# EAGLE design Breadboard (EAGLE 9.4.2)
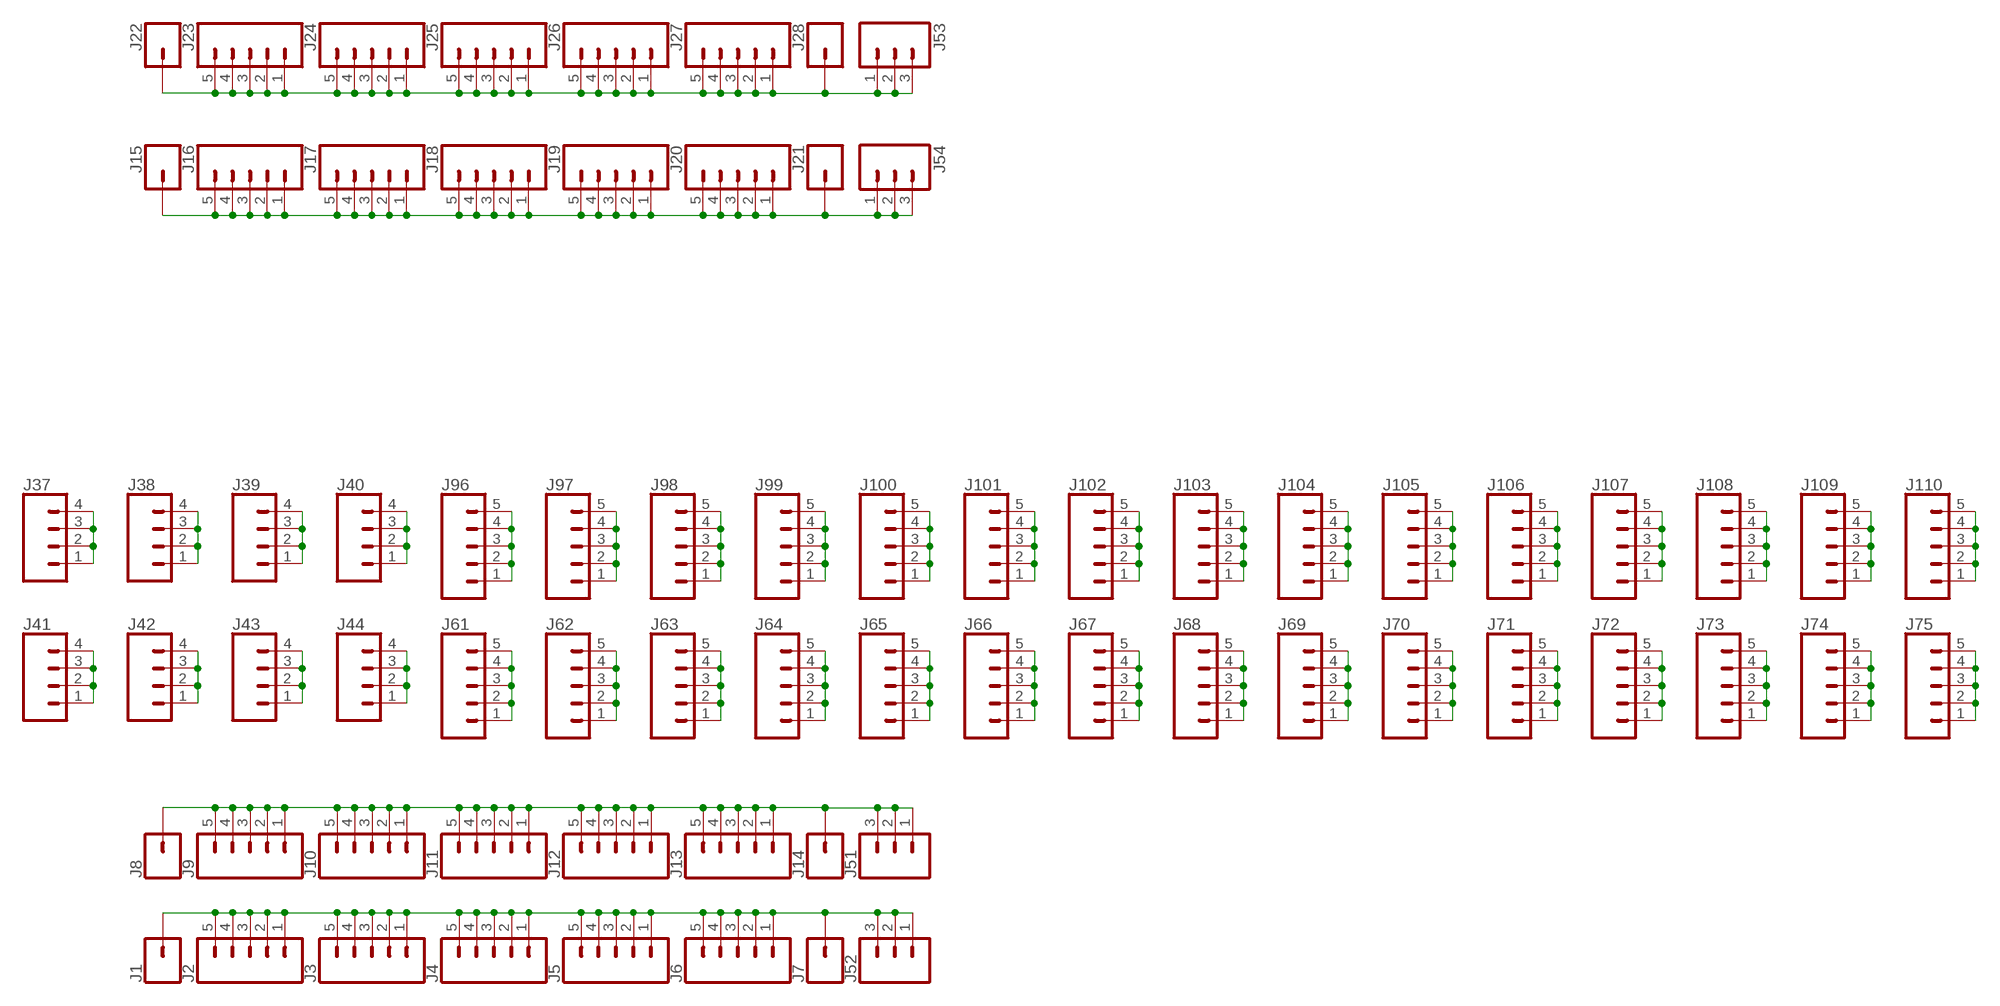
[diagram p0: schematic, sheet 1, part 1 of 2]
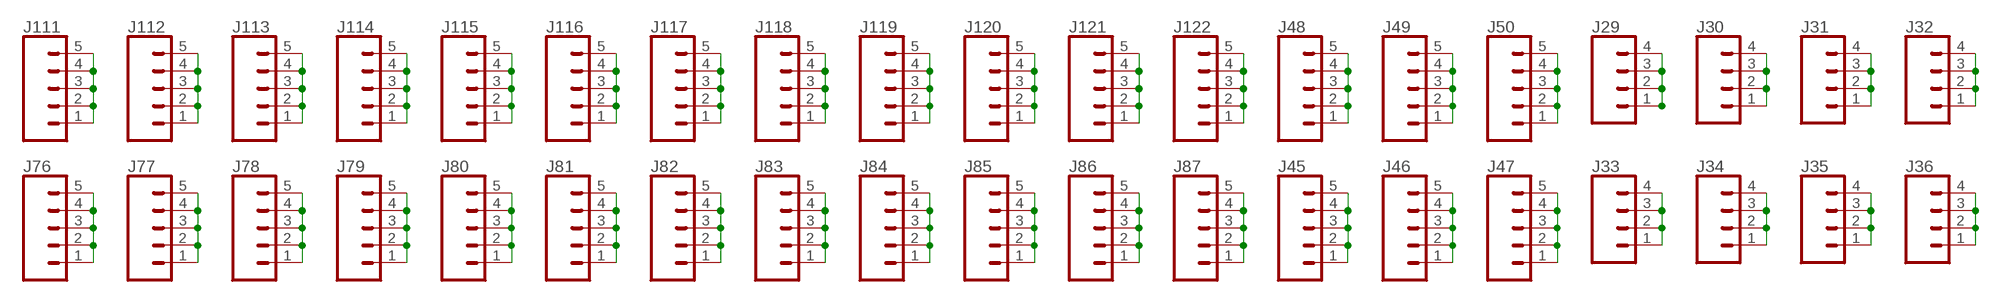
[diagram p1: schematic, sheet 1, part 2 of 2]

## Parts
J1  CONN_01  [1X01]
J2  CONN_05  [1X05]
J3  CONN_05  [1X05]
J4  CONN_05  [1X05]
J5  CONN_05  [1X05]
J6  CONN_05  [1X05]
J7  CONN_01  [1X01]
J8  CONN_01  [1X01]
J9  CONN_05  [1X05]
J10  CONN_05  [1X05]
J11  CONN_05  [1X05]
J12  CONN_05  [1X05]
J13  CONN_05  [1X05]
J14  CONN_01  [1X01]
J15  CONN_01  [1X01]
J16  CONN_05  [1X05]
J17  CONN_05  [1X05]
J18  CONN_05  [1X05]
J19  CONN_05  [1X05]
J20  CONN_05  [1X05]
J21  CONN_01  [1X01]
J22  CONN_01  [1X01]
J23  CONN_05  [1X05]
J24  CONN_05  [1X05]
J25  CONN_05  [1X05]
J26  CONN_05  [1X05]
J27  CONN_05  [1X05]
J28  CONN_01  [1X01]
J29  CONN_04PTH  [1X04]
J30  CONN_04PTH  [1X04]
J31  CONN_04PTH  [1X04]
J32  CONN_04PTH  [1X04]
J33  CONN_04PTH  [1X04]
J34  CONN_04PTH  [1X04]
J35  CONN_04PTH  [1X04]
J36  CONN_04PTH  [1X04]
J37  CONN_04PTH  [1X04]
J38  CONN_04PTH  [1X04]
J39  CONN_04PTH  [1X04]
J40  CONN_04PTH  [1X04]
J41  CONN_04PTH  [1X04]
J42  CONN_04PTH  [1X04]
J43  CONN_04PTH  [1X04]
J44  CONN_04PTH  [1X04]
J45  CONN_05  [1X05]
J46  CONN_05  [1X05]
J47  CONN_05  [1X05]
J48  CONN_05  [1X05]
J49  CONN_05  [1X05]
J50  CONN_05  [1X05]
J51  455-1750-1-ND  CONN_03  [1X03]
J52  455-1750-1-ND  CONN_03  [1X03]
J53  455-1750-1-ND  CONN_03  [1X03]
J54  455-1750-1-ND  CONN_03  [1X03]
J61  CONN_05  [1X05]
J62  CONN_05  [1X05]
J63  CONN_05  [1X05]
J64  CONN_05  [1X05]
J65  CONN_05  [1X05]
J66  CONN_05  [1X05]
J67  CONN_05  [1X05]
J68  CONN_05  [1X05]
J69  CONN_05  [1X05]
J70  CONN_05  [1X05]
J71  CONN_05  [1X05]
J72  CONN_05  [1X05]
J73  CONN_05  [1X05]
J74  CONN_05  [1X05]
J75  CONN_05  [1X05]
J76  CONN_05  [1X05]
J77  CONN_05  [1X05]
J78  CONN_05  [1X05]
J79  CONN_05  [1X05]
J80  CONN_05  [1X05]
J81  CONN_05  [1X05]
J82  CONN_05  [1X05]
J83  CONN_05  [1X05]
J84  CONN_05  [1X05]
J85  CONN_05  [1X05]
J86  CONN_05  [1X05]
J87  CONN_05  [1X05]
J96  CONN_05  [1X05]
J97  CONN_05  [1X05]
J98  CONN_05  [1X05]
J99  CONN_05  [1X05]
J100  CONN_05  [1X05]
J101  CONN_05  [1X05]
J102  CONN_05  [1X05]
J103  CONN_05  [1X05]
J104  CONN_05  [1X05]
J105  CONN_05  [1X05]
J106  CONN_05  [1X05]
J107  CONN_05  [1X05]
J108  CONN_05  [1X05]
J109  CONN_05  [1X05]
J110  CONN_05  [1X05]
J111  CONN_05  [1X05]
J112  CONN_05  [1X05]
J113  CONN_05  [1X05]
J114  CONN_05  [1X05]
J115  CONN_05  [1X05]
J116  CONN_05  [1X05]
J117  CONN_05  [1X05]
J118  CONN_05  [1X05]
J119  CONN_05  [1X05]
J120  CONN_05  [1X05]
J121  CONN_05  [1X05]
J122  CONN_05  [1X05]

## Nets
N$1: J1.1 J2.1 J2.2 J2.3 J2.4 J2.5 J3.1 J3.2 J3.3 J3.4 J3.5 J4.1 J4.2 J4.3 J4.4 J4.5 J5.1 J5.2 J5.3 J5.4 J5.5 J6.1 J6.2 J6.3 J6.4 J6.5 J7.1 J52.1 J52.2 J52.3
N$2: J8.1 J9.1 J9.2 J9.3 J9.4 J9.5 J10.1 J10.2 J10.3 J10.4 J10.5 J11.1 J11.2 J11.3 J11.4 J11.5 J12.1 J12.2 J12.3 J12.4 J12.5 J13.1 J13.2 J13.3 J13.4 J13.5 J14.1 J51.1 J51.2 J51.3
N$3: J15.1 J16.1 J16.2 J16.3 J16.4 J16.5 J17.1 J17.2 J17.3 J17.4 J17.5 J18.1 J18.2 J18.3 J18.4 J18.5 J19.1 J19.2 J19.3 J19.4 J19.5 J20.1 J20.2 J20.3 J20.4 J20.5 J21.1 J54.1 J54.2 J54.3
N$4: J22.1 J23.1 J23.2 J23.3 J23.4 J23.5 J24.1 J24.2 J24.3 J24.4 J24.5 J25.1 J25.2 J25.3 J25.4 J25.5 J26.1 J26.2 J26.3 J26.4 J26.5 J27.1 J27.2 J27.3 J27.4 J27.5 J28.1 J53.1 J53.2 J53.3
N$5: J41.1 J41.2 J41.3 J41.4
N$6: J42.1 J42.2 J42.3 J42.4
N$7: J43.1 J43.2 J43.3 J43.4
N$8: J44.1 J44.2 J44.3 J44.4
N$9: J61.1 J61.2 J61.3 J61.4 J61.5
N$10: J62.1 J62.2 J62.3 J62.4 J62.5
N$11: J63.1 J63.2 J63.3 J63.4 J63.5
N$12: J64.1 J64.2 J64.3 J64.4 J64.5
N$13: J65.1 J65.2 J65.3 J65.4 J65.5
N$14: J66.1 J66.2 J66.3 J66.4 J66.5
N$15: J67.1 J67.2 J67.3 J67.4 J67.5
N$16: J68.1 J68.2 J68.3 J68.4 J68.5
N$17: J69.1 J69.2 J69.3 J69.4 J69.5
N$18: J70.1 J70.2 J70.3 J70.4 J70.5
N$19: J71.1 J71.2 J71.3 J71.4 J71.5
N$20: J72.1 J72.2 J72.3 J72.4 J72.5
N$21: J73.1 J73.2 J73.3 J73.4 J73.5
N$22: J74.1 J74.2 J74.3 J74.4 J74.5
N$23: J75.1 J75.2 J75.3 J75.4 J75.5
N$24: J76.1 J76.2 J76.3 J76.4 J76.5
N$25: J77.1 J77.2 J77.3 J77.4 J77.5
N$26: J78.1 J78.2 J78.3 J78.4 J78.5
N$27: J79.1 J79.2 J79.3 J79.4 J79.5
N$28: J80.1 J80.2 J80.3 J80.4 J80.5
N$29: J81.1 J81.2 J81.3 J81.4 J81.5
N$30: J82.1 J82.2 J82.3 J82.4 J82.5
N$31: J83.1 J83.2 J83.3 J83.4 J83.5
N$32: J84.1 J84.2 J84.3 J84.4 J84.5
N$33: J85.1 J85.2 J85.3 J85.4 J85.5
N$34: J86.1 J86.2 J86.3 J86.4 J86.5
N$35: J87.1 J87.2 J87.3 J87.4 J87.5
N$36: J33.1 J33.2 J33.3 J33.4
N$37: J34.1 J34.2 J34.3 J34.4
N$38: J35.1 J35.2 J35.3 J35.4
N$39: J36.1 J36.2 J36.3 J36.4
N$40: J37.1 J37.2 J37.3 J37.4
N$41: J38.1 J38.2 J38.3 J38.4
N$42: J39.1 J39.2 J39.3 J39.4
N$43: J40.1 J40.2 J40.3 J40.4
N$44: J96.1 J96.2 J96.3 J96.4 J96.5
N$45: J97.1 J97.2 J97.3 J97.4 J97.5
N$46: J98.1 J98.2 J98.3 J98.4 J98.5
N$47: J99.1 J99.2 J99.3 J99.4 J99.5
N$48: J100.1 J100.2 J100.3 J100.4 J100.5
N$49: J101.1 J101.2 J101.3 J101.4 J101.5
N$50: J102.1 J102.2 J102.3 J102.4 J102.5
N$51: J103.1 J103.2 J103.3 J103.4 J103.5
N$52: J104.1 J104.2 J104.3 J104.4 J104.5
N$53: J105.1 J105.2 J105.3 J105.4 J105.5
N$54: J106.1 J106.2 J106.3 J106.4 J106.5
N$55: J107.1 J107.2 J107.3 J107.4 J107.5
N$56: J108.1 J108.2 J108.3 J108.4 J108.5
N$57: J109.1 J109.2 J109.3 J109.4 J109.5
N$58: J110.1 J110.2 J110.3 J110.4 J110.5
N$59: J111.1 J111.2 J111.3 J111.4 J111.5
N$60: J112.1 J112.2 J112.3 J112.4 J112.5
N$61: J113.1 J113.2 J113.3 J113.4 J113.5
N$62: J114.1 J114.2 J114.3 J114.4 J114.5
N$63: J115.1 J115.2 J115.3 J115.4 J115.5
N$64: J116.1 J116.2 J116.3 J116.4 J116.5
N$65: J117.1 J117.2 J117.3 J117.4 J117.5
N$66: J118.1 J118.2 J118.3 J118.4 J118.5
N$67: J119.1 J119.2 J119.3 J119.4 J119.5
N$68: J120.1 J120.2 J120.3 J120.4 J120.5
N$69: J121.1 J121.2 J121.3 J121.4 J121.5
N$70: J122.1 J122.2 J122.3 J122.4 J122.5
N$71: J29.1 J29.2 J29.3 J29.4
N$72: J30.1 J30.2 J30.3 J30.4
N$73: J31.1 J31.2 J31.3 J31.4
N$74: J32.1 J32.2 J32.3 J32.4
N$75: J48.1 J48.2 J48.3 J48.4 J48.5
N$76: J45.1 J45.2 J45.3 J45.4 J45.5
N$77: J46.1 J46.2 J46.3 J46.4 J46.5
N$78: J47.1 J47.2 J47.3 J47.4 J47.5
N$79: J49.1 J49.2 J49.3 J49.4 J49.5
N$80: J50.1 J50.2 J50.3 J50.4 J50.5

## Library data of the parts
J1 J7 J8 J14 J15 J21 J22 J28 = SparkFun-Connectors:CONN_01: Single connection point. Often used as Generic Header-pin footprint for 0.1 inch spaced/style header connections On any of the 0.1 inch spaced packages, you can populate with these: Break Away Headers - Straight <https://www.sparkfun.com/products/116> (PRT-00116) Break Away Male Headers - Right Angle <https://www.sparkfun.com/products/553> (PRT-00553) Female Headers <https://www.sparkfun.com/products/115> (PRT-00115) Break Away Headers - Machine Pin <https://www.sparkfun.com/products/117> (PRT-00117) Break Away Female Headers - Swiss Machine Pin <https://www.sparkfun.com/products/743> (PRT-00743) This device is also useful as a general connection point to wire up your design to another part of your project. Our various solder wires solder well into these plated through hole pads. Hook-Up Wire - Assortment (Stranded, 22 AWG) <https://www.sparkfun.com/products/11375> (PRT-11375) Hook-Up Wire - Assortment (Solid Core, 22 AWG) <https://www.sparkfun.com/products/11367> (PRT-11367) View the entire wire category on our website here <https://www.sparkfun.com/categories/141> Special notes: SMTSO-256-ET is a "flush mount" nut for a 4-40 screw. We mostly use this on specialty testbeds; it is a nice way to connect hardware to your PCB at an adjustable hieght. Also note, the SNAP packages are for using a snappable style connector. We sell a baggie of snaps and they are also used on two LilyPad designs: Snap Assortment - 30 pack (male and female) <https://www.sparkfun.com/products/11347> (DEV-11347) LilyPad Arduino SimpleSnap <https://www.sparkfun.com/products/10941> (DEV-10941) LilyPad SimpleSnap Protoboard <https://www.sparkfun.com/products/10940> (DEV-10940)
J2-J6 J9-J13 J16-J20 J23-J27 J45-J50 J61-J87 J96-J122 = SparkFun-Connectors:CONN_05: Multi connection point. Often used as Generic Header-pin footprint for 0.1 inch spaced/style header connections On any of the 0.1 inch spaced packages, you can populate with these: Break Away Headers - Straight <https://www.sparkfun.com/products/116> (PRT-00116) Break Away Male Headers - Right Angle <https://www.sparkfun.com/products/553> (PRT-00553) Female Headers <https://www.sparkfun.com/products/115> (PRT-00115) Break Away Headers - Machine Pin <https://www.sparkfun.com/products/117> (PRT-00117) Break Away Female Headers - Swiss Machine Pin <https://www.sparkfun.com/products/743> (PRT-00743) For SCREWTERMINALS and SPRING TERMINALS visit here: Screw Terimnals on SparkFun.com <https://www.sparkfun.com/search/results?term=Screw+Terminals> (5mm/3.5mm/2.54mm spacing) This device is also useful as a general connection point to wire up your design to another part of your project. Our various solder wires solder well into these plated through hole pads. Hook-Up Wire - Assortment (Stranded, 22 AWG) <https://www.sparkfun.com/products/11375> (PRT-11375) Hook-Up Wire - Assortment (Solid Core, 22 AWG) <https://www.sparkfun.com/products/11367> (PRT-11367) View the entire wire category on our website here <https://www.sparkfun.com/categories/141> Special notes: Molex polarized connector foot print use with SKU : PRT-08231 with associated crimp pins and housings. 1MM SMD Version SKU: PRT-10208
J29-J44 = SparkFun-Connectors:CONN_04: Multi connection point. Often used as Generic Header-pin footprint for 0.1 inch spaced/style header connections On any of the 0.1 inch spaced packages, you can populate with these: Break Away Headers - Straight <https://www.sparkfun.com/products/116> (PRT-00116) Break Away Male Headers - Right Angle <https://www.sparkfun.com/products/553> (PRT-00553) Female Headers <https://www.sparkfun.com/products/115> (PRT-00115) Break Away Headers - Machine Pin <https://www.sparkfun.com/products/117> (PRT-00117) Break Away Female Headers - Swiss Machine Pin <https://www.sparkfun.com/products/743> (PRT-00743) For SCREWTERMINALS and SPRING TERMINALS visit here: Screw Terimnals on SparkFun.com <https://www.sparkfun.com/search/results?term=Screw+Terminals> (5mm/3.5mm/2.54mm spacing) This device is also useful as a general connection point to wire up your design to another part of your project. Our various solder wires solder well into these plated through hole pads. Hook-Up Wire - Assortment (Stranded, 22 AWG) <https://www.sparkfun.com/products/11375> (PRT-11375) Hook-Up Wire - Assortment (Solid Core, 22 AWG) <https://www.sparkfun.com/products/11367> (PRT-11367) View the entire wire category on our website here <https://www.sparkfun.com/categories/141> Special notes: Molex polarized connector foot print use with SKU : PRT-08231 with associated crimp pins and housings. 1MM SMD Version SKU: PRT-10208; PROD_ID: CONN-09696
J51-J54 = SparkFun-Connectors:CONN_03: Multi connection point. Often used as Generic Header-pin footprint for 0.1 inch spaced/style header connections On any of the 0.1 inch spaced packages, you can populate with these: Break Away Headers - Straight <https://www.sparkfun.com/products/116> (PRT-00116) Break Away Male Headers - Right Angle <https://www.sparkfun.com/products/553> (PRT-00553) Female Headers <https://www.sparkfun.com/products/115> (PRT-00115) Break Away Headers - Machine Pin <https://www.sparkfun.com/products/117> (PRT-00117) Break Away Female Headers - Swiss Machine Pin <https://www.sparkfun.com/products/743> (PRT-00743) Stackable Header - 3 Pin (Female, 0.1") <https://www.sparkfun.com/products/13875> (PRT-13875) For SCREWTERMINALS and SPRING TERMINALS visit here: Screw Terimnals on SparkFun.com <https://www.sparkfun.com/search/results?term=Screw+Terminals> (5mm/3.5mm/2.54mm spacing) This device is also useful as a general connection point to wire up your design to another part of your project. Our various solder wires solder well into these plated through hole pads. Hook-Up Wire - Assortment (Stranded, 22 AWG) <https://www.sparkfun.com/products/11375> (PRT-11375) Hook-Up Wire - Assortment (Solid Core, 22 AWG) <https://www.sparkfun.com/products/11367> (PRT-11367) View the entire wire category on our website here <https://www.sparkfun.com/categories/141> Special notes: Molex polarized connector foot print use with SKU : PRT-08232 with associated crimp pins and housings.; PROD_ID: XXX-00000

## Board
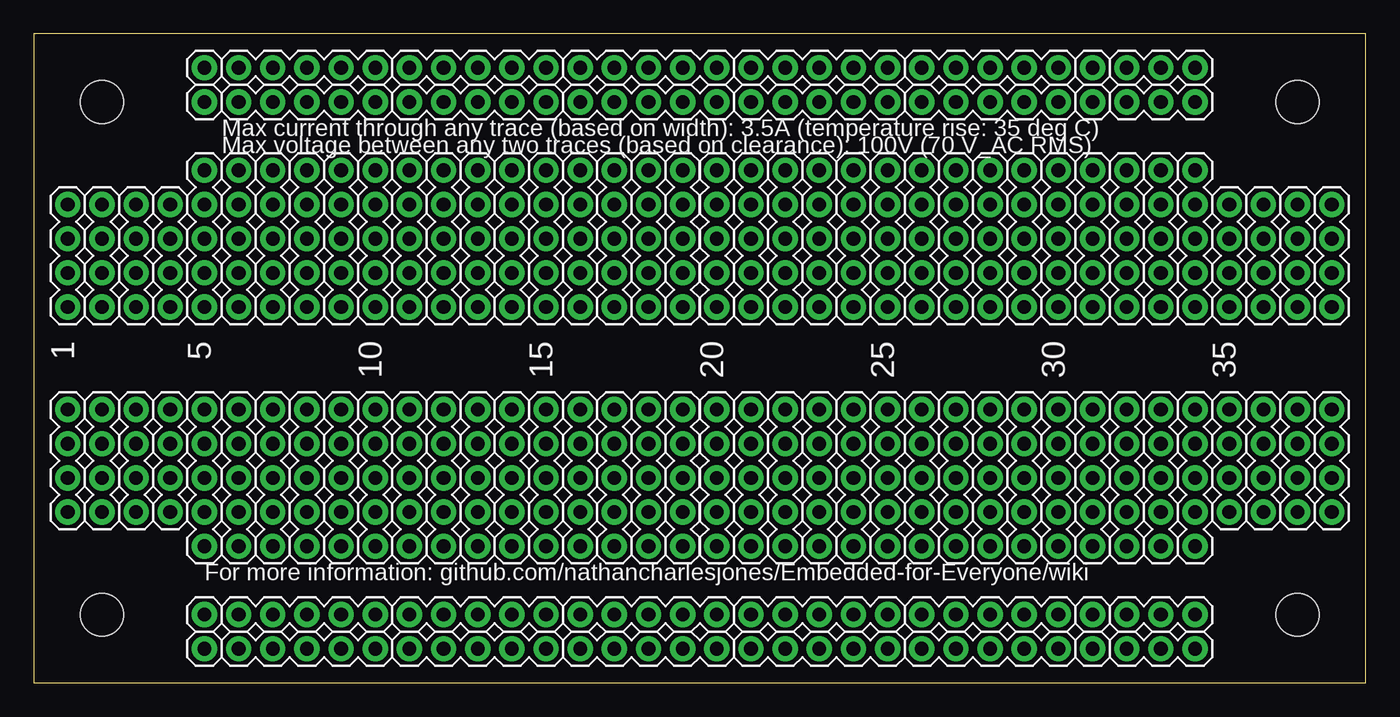
[diagram p2: board, top side]
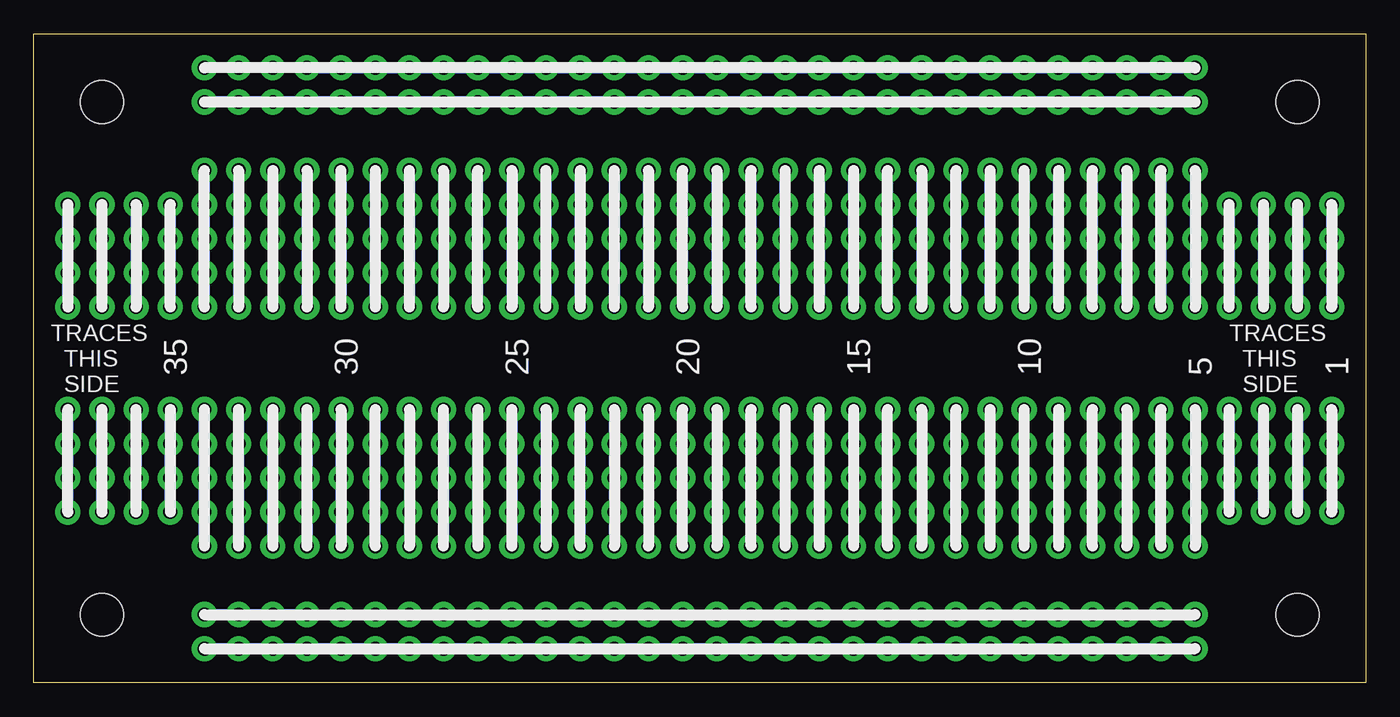
[diagram p3: board, bottom side, seen from below]

Size 99.06 x 48.26 mm. Coordinates in mm from the lower left corner, seen from the top.
Outline: 0,0 99.06,0 99.06,48.26 0,48.26 0,0
Copper layers (1*16): Top 0.035mm / dielectric 1.5mm / Bottom 0.035mm
Design rules "OthermillDRC_1_64_v2": minimum track width 16mil, minimum drill 31mil, track to track 0.39878125mm, track to pad 0.39878125mm, pad to pad 0.39878125mm, via to via 0.39878125mm, smd to smd 0mil, copper to edge 0mil, drill to drill 1mil, minimum pad ring 0mil, minimum via ring 15mil, stop-mask expansion 1mil, vias tented up to drill 30mil, thermal gap 10mil
Holes 3.17 mm at 93.98,43.18 93.98,5.08 5.08,43.18 5.08,5.08

### Footprints (pad centres in the part's own frame; a part is rotated, then mirrored left to right if it is on the bottom)
1X01 = drill 1.016 pad 1.88: 1 0,0
1X05 = drill 1.016 pad 1.88: 1 0,0; 2 2.54,0; 3 5.08,0; 4 7.62,0; 5 10.16,0
1X04 = drill 1.016 pad 1.88: 1 0,0; 2 2.54,0; 3 5.08,0; 4 7.62,0
1X03 = drill 1.016 pad 1.88: 1 0,0; 2 2.54,0; 3 5.08,0

### Placement (x,y rotation side)
J1  12.7,2.54 0 top
J2  15.24,2.54 0 top
J3  27.94,2.54 0 top
J4  40.64,2.54 0 top
J5  53.34,2.54 0 top
J6  66.04,2.54 0 top
J7  78.74,2.54 0 top
J8  12.7,5.08 0 top
J9  15.24,5.08 0 top
J10  27.94,5.08 0 top
J11  40.64,5.08 0 top
J12  53.34,5.08 0 top
J13  66.04,5.08 0 top
J14  78.74,5.08 0 top
J15  12.7,43.18 180 top
J16  15.24,43.18 0 top
J17  27.94,43.18 0 top
J18  40.64,43.18 0 top
J19  53.34,43.18 0 top
J20  66.04,43.18 0 top
J21  78.74,43.18 0 top
J22  12.7,45.72 180 top
J23  15.24,45.72 0 top
J24  27.94,45.72 0 top
J25  40.64,45.72 0 top
J26  53.34,45.72 0 top
J27  66.04,45.72 0 top
J28  78.74,45.72 0 top
J29  88.9,27.94 90 top
J30  91.44,27.94 90 top
J31  93.98,27.94 90 top
J32  96.52,27.94 90 top
J33  88.9,12.7 90 top
J34  91.44,12.7 90 top
J35  93.98,12.7 90 top
J36  96.52,12.7 90 top
J37  2.54,27.94 90 top
J38  5.08,27.94 90 top
J39  7.62,27.94 90 top
J40  10.16,27.94 90 top
J41  2.54,12.7 90 top
J42  5.08,12.7 90 top
J43  7.62,12.7 90 top
J44  10.16,12.7 90 top
J45  81.28,10.16 90 top
J46  83.82,10.16 90 top
J47  86.36,10.16 90 top
J48  81.28,27.94 90 top
J49  83.82,27.94 90 top
J50  86.36,27.94 90 top
J51  81.28,5.08 0 top
J52  81.28,2.54 0 top
J53  81.28,45.72 0 top
J54  81.28,43.18 0 top
J61  12.7,10.16 90 top
J62  15.24,10.16 90 top
J63  17.78,10.16 90 top
J64  20.32,10.16 90 top
J65  22.86,10.16 90 top
J66  25.4,10.16 90 top
J67  27.94,10.16 90 top
J68  30.48,10.16 90 top
J69  33.02,10.16 90 top
J70  35.56,10.16 90 top
J71  38.1,10.16 90 top
J72  40.64,10.16 90 top
J73  43.18,10.16 90 top
J74  45.72,10.16 90 top
J75  48.26,10.16 90 top
J76  50.8,10.16 90 top
J77  53.34,10.16 90 top
J78  55.88,10.16 90 top
J79  58.42,10.16 90 top
J80  60.96,10.16 90 top
J81  63.5,10.16 90 top
J82  66.04,10.16 90 top
J83  68.58,10.16 90 top
J84  71.12,10.16 90 top
J85  73.66,10.16 90 top
J86  76.2,10.16 90 top
J87  78.74,10.16 90 top
J96  12.7,27.94 90 top
J97  15.24,27.94 90 top
J98  17.78,27.94 90 top
J99  20.32,27.94 90 top
J100  22.86,27.94 90 top
J101  25.4,27.94 90 top
J102  27.94,27.94 90 top
J103  30.48,27.94 90 top
J104  33.02,27.94 90 top
J105  35.56,27.94 90 top
J106  38.1,27.94 90 top
J107  40.64,27.94 90 top
J108  43.18,27.94 90 top
J109  45.72,27.94 90 top
J110  48.26,27.94 90 top
J111  50.8,27.94 90 top
J112  53.34,27.94 90 top
J113  55.88,27.94 90 top
J114  58.42,27.94 90 top
J115  60.96,27.94 90 top
J116  63.5,27.94 90 top
J117  66.04,27.94 90 top
J118  68.58,27.94 90 top
J119  71.12,27.94 90 top
J120  73.66,27.94 90 top
J121  76.2,27.94 90 top
J122  78.74,27.94 90 top

### Tracks (layer width: path | path; a pad name or v marks a point on that pad's centre or on a via)
N$1
  Bottom 0.813: J1.1 J2.1 J2.2 J2.3 J2.4 J2.5 J3.1 J3.2 J3.3 J3.4 J3.5 J4.1 J4.2 J4.3 J4.4 J4.5 J5.1 J5.2 J5.3 J5.4 J5.5 J6.1 J6.2 J6.3 J6.4 J6.5 J7.1 J52.1 J52.2 J52.3
N$2
  Bottom 0.813: J8.1 J9.1 J9.2 J9.3 J9.4 J9.5 J10.1 J10.2 J10.3 J10.4 J10.5 J11.1 J11.2 J11.3 J11.4 J11.5 J12.1 J12.2 J12.3 J12.4 J12.5 J13.1 J13.2 J13.3 J13.4 J13.5 J14.1 J51.1 J51.2 J51.3
N$3
  Bottom 0.813: J15.1 J16.1 J16.2 J16.3 J16.4 J16.5 J17.1 J17.2 J17.3 J17.4 J17.5 J18.1 J18.2 J18.3 J18.4 J18.5 J19.1 J19.2 J19.3 J19.4 J19.5 J20.1 J20.2 J20.3 J20.4 J20.5 J21.1 J54.1 J54.2 J54.3
N$4
  Bottom 0.813: J22.1 J23.1 J23.2 J23.3 J23.4 J23.5 J24.1 J24.2 J24.3 J24.4 J24.5 J25.1 J25.2 J25.3 J25.4 J25.5 J26.1 J26.2 J26.3 J26.4 J26.5 J27.1 J27.2 J27.3 J27.4 J27.5 J28.1 J53.1 J53.2 J53.3
N$5
  Bottom 0.813: J41.4 J41.3 J41.2 J41.1
N$6
  Bottom 0.813: J42.4 J42.3 J42.2 J42.1
N$7
  Bottom 0.813: J43.1 J43.2 J43.3 J43.4
N$8
  Bottom 0.813: J44.4 J44.3 J44.2 J44.1
N$9
  Bottom 0.813: J61.5 J61.4 J61.3 J61.2 J61.1
N$10
  Bottom 0.813: J62.1 J62.2 J62.3 J62.4 J62.5
N$11
  Bottom 0.813: J63.5 J63.4 J63.3 J63.2 J63.1
N$12
  Bottom 0.813: J64.1 J64.2 J64.3 J64.4 J64.5
N$13
  Bottom 0.813: J65.5 J65.4 J65.3 J65.2 J65.1
N$14
  Bottom 0.813: J66.1 J66.2 J66.3 J66.4 J66.5
N$15
  Bottom 0.813: J67.5 J67.4 J67.3 J67.2 J67.1
N$16
  Bottom 0.813: J68.1 J68.2 J68.3 J68.4 J68.5
N$17
  Bottom 0.813: J69.5 J69.4 J69.3 J69.2 J69.1
N$18
  Bottom 0.813: J70.1 J70.2 J70.3 J70.4 J70.5
N$19
  Bottom 0.813: J71.5 J71.4 J71.3 J71.2 J71.1
N$20
  Bottom 0.813: J72.1 J72.2 J72.3 J72.4 J72.5
N$21
  Bottom 0.813: J73.5 J73.4 J73.3 J73.2 J73.1
N$22
  Bottom 0.813: J74.1 J74.2 J74.3 J74.4 J74.5
N$23
  Bottom 0.813: J75.5 J75.4 J75.3 J75.2 J75.1
N$24
  Bottom 0.813: J76.1 J76.2 J76.3 J76.4 J76.5
N$25
  Bottom 0.813: J77.5 J77.4 J77.3 J77.2 J77.1
N$26
  Bottom 0.813: J78.1 J78.2 J78.3 J78.4 J78.5
N$27
  Bottom 0.813: J79.5 J79.4 J79.3 J79.2 J79.1
N$28
  Bottom 0.813: J80.1 J80.2 J80.3 J80.4 J80.5
N$29
  Bottom 0.813: J81.5 J81.4 J81.3 J81.2 J81.1
N$30
  Bottom 0.813: J82.1 J82.2 J82.3 J82.4 J82.5
N$31
  Bottom 0.813: J83.5 J83.4 J83.3 J83.2 J83.1
N$32
  Bottom 0.813: J84.1 J84.2 J84.3 J84.4 J84.5
N$33
  Bottom 0.813: J85.5 J85.4 J85.3 J85.2 J85.1
N$34
  Bottom 0.813: J86.1 J86.2 J86.3 J86.4 J86.5
N$35
  Bottom 0.813: J87.5 J87.4 J87.3 J87.2 J87.1
N$36
  Bottom 0.813: J33.1 J33.2 J33.3 J33.4
N$37
  Bottom 0.813: J34.4 J34.3 J34.2 J34.1
N$38
  Bottom 0.813: J35.1 J35.2 J35.3 J35.4
N$39
  Bottom 0.813: J36.4 J36.3 J36.2 J36.1
N$40
  Bottom 0.813: J37.1 J37.2 J37.3 J37.4
N$41
  Bottom 0.813: J38.4 J38.3 J38.2 J38.1
N$42
  Bottom 0.813: J39.1 J39.2 J39.3 J39.4
N$43
  Bottom 0.813: J40.4 J40.3 J40.2 J40.1
N$44
  Bottom 0.813: J96.1 J96.2 J96.3 J96.4 J96.5
N$45
  Bottom 0.813: J97.1 J97.2 J97.3 J97.4 J97.5
N$46
  Bottom 0.813: J98.1 J98.2 J98.3 J98.4 J98.5
N$47
  Bottom 0.813: J99.5 J99.4 J99.3 J99.2 J99.1
N$48
  Bottom 0.813: J100.1 J100.2 J100.3 J100.4 J100.5
N$49
  Bottom 0.813: J101.5 J101.4 J101.3 J101.2 J101.1
N$50
  Bottom 0.813: J102.1 J102.2 J102.3 J102.4 J102.5
N$51
  Bottom 0.813: J103.5 J103.4 J103.3 J103.2 J103.1
N$52
  Bottom 0.813: J104.1 J104.2 J104.3 J104.4 J104.5
N$53
  Bottom 0.813: J105.5 J105.4 J105.3 J105.2 J105.1
N$54
  Bottom 0.813: J106.1 J106.2 J106.3 J106.4 J106.5
N$55
  Bottom 0.813: J107.5 J107.4 J107.3 J107.2 J107.1
N$56
  Bottom 0.813: J108.1 J108.2 J108.3 J108.4 J108.5
N$57
  Bottom 0.813: J109.5 J109.4 J109.3 J109.2 J109.1
N$58
  Bottom 0.813: J110.1 J110.2 J110.3 J110.4 J110.5
N$59
  Bottom 0.813: J111.5 J111.4 J111.3 J111.2 J111.1
N$60
  Bottom 0.813: J112.1 J112.2 J112.3 J112.4 J112.5
N$61
  Bottom 0.813: J113.5 J113.4 J113.3 J113.2 J113.1
N$62
  Bottom 0.813: J114.1 J114.2 J114.3 J114.4 J114.5
N$63
  Bottom 0.813: J115.5 J115.4 J115.3 J115.2 J115.1
N$64
  Bottom 0.813: J116.1 J116.2 J116.3 J116.4 J116.5
N$65
  Bottom 0.813: J117.5 J117.4 J117.3 J117.2 J117.1
N$66
  Bottom 0.813: J118.1 J118.2 J118.3 J118.4 J118.5
N$67
  Bottom 0.813: J119.5 J119.4 J119.3 J119.2 J119.1
N$68
  Bottom 0.813: J120.1 J120.2 J120.3 J120.4 J120.5
N$69
  Bottom 0.813: J121.5 J121.4 J121.3 J121.2 J121.1
N$70
  Bottom 0.813: J122.1 J122.2 J122.3 J122.4 J122.5
N$71
  Bottom 0.813: J29.4 J29.3 J29.2 J29.1
N$72
  Bottom 0.813: J30.1 J30.2 J30.3 J30.4
N$73
  Bottom 0.813: J31.4 J31.3 J31.2 J31.1
N$74
  Bottom 0.813: J32.1 J32.2 J32.3 J32.4
N$75
  Bottom 0.813: J48.5 J48.4 J48.3 J48.2 J48.1
N$76
  Bottom 0.813: J45.1 J45.2 J45.3 J45.4 J45.5
N$77
  Bottom 0.813: J46.5 J46.4 J46.3 J46.2 J46.1
N$78
  Bottom 0.813: J47.1 J47.2 J47.3 J47.4 J47.5
N$79
  Bottom 0.813: J49.1 J49.2 J49.3 J49.4 J49.5
N$80
  Bottom 0.813: J50.5 J50.4 J50.3 J50.2 J50.1

### Text on the board
bPlace: 1 | 5 | 10 | 15 | 20 | 25 | 30 | 35
tNames: Max current through any trace (based on width): 3.5A (temperature rise: 35 deg C) | Max voltage between any two traces (based on clearance): 100V (70 V_AC RMS) | 1 | 5 | 10 | 15 | 20 | 25 | 30 | 35 | For more information: github.com/nathancharlesjones/Embedded-for-Everyone/wiki
bNames: TRACES / THIS / SIDE | TRACES / THIS / SIDE